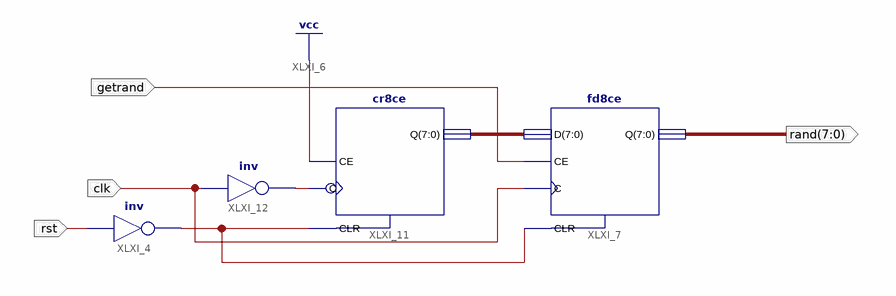
[diagram p0: schematic sheet 1]
// Xilinx ISE schematic rand.sch (xc9500xl) as structural Verilog: 4 symbols, 4 ports
module \rand  (
  input  rst,
  input  clk,
  input  getrand,
  output [7:0] \rand 
);

  wire XLXN_61, XLXN_62;
  wire [7:0] XLXN_35;

  fd8ce XLXI_7 (.C(clk), .CE(getrand), .CLR(XLXN_62), .D(XLXN_35), .Q(\rand ));
  cr8ce XLXI_11 (.C(XLXN_61), .CE(1'b1), .CLR(XLXN_62), .Q(XLXN_35));
  not XLXI_12 (XLXN_61, clk);
  not XLXI_4 (XLXN_62, rst);
endmodule
